# Altium schematic sheet taideng.SchDoc
size A4
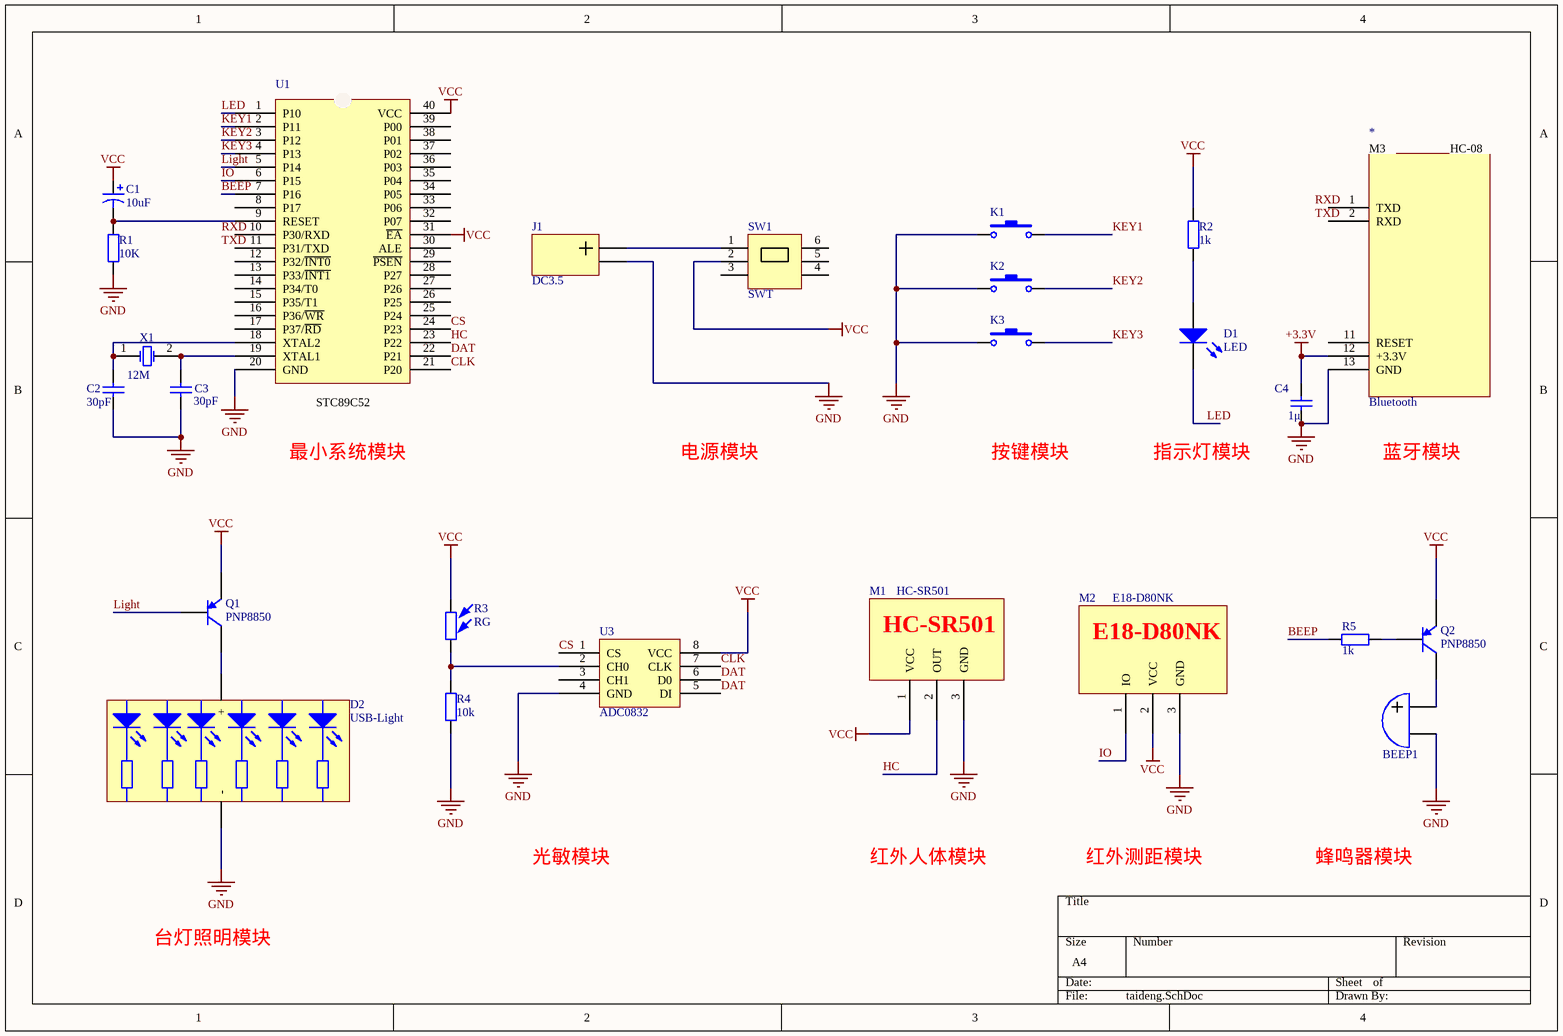
[diagram p0: taideng.SchDoc]

## Parts
*  Bluetooth  [HC-08V20/22/41]
BEEP1  BEEP  [BEEP]  (value not drawn)
C1  10uF  [CAP_2]
C2  30pF  [CAP]
C3  30pF  [CAP]
C4  1μ  [CAP]
D1  LED  [LED]
D2  USB-Light  [USB-A - 2]
J1  DC3.5  [DC3.5]
K1  KEY  [KEY]  (value not drawn)
K2  KEY  [KEY]  (value not drawn)
K3  KEY  [KEY]  (value not drawn)
M1  HC-SR501  [HC-SR501]
M2  E18-D80NK  [SIP3]
Q1  PNP8850  [NPN]
Q2  PNP8850  [NPN]
R1  10K  [RES]
R2  1k  [RES]
R3  RG  [RG]
R4  10k  [RES]
R5  1k  [RES]
SW1  SWT  [SWT]
U1  STC89C52  [DIP40]  (value not drawn)
U3  ADC0832  [DIP8]
X1  12M  [XTAL]

## Nets
+3.3V: *.12(+3.3V) C4.2
GND: *.13(GND) BEEP1.2 C2.1 C3.1 C4.1 D2.2(-) J1.2 K1.1 K2.1 K3.1 M1.3(GND) M2.3(GND) R1.1 R4.1 U1.20(GND) U3.4(GND)
VCC: C1.1 M1.1(VCC) M2.2(VCC) Q1.E Q2.E R2.2 R3.1 SW1.2 U1.31(~{EA}) U1.40(VCC) U3.8(VCC)
BEEP: R5.1 U1.7(P16)
CLK: U1.21(P20) U3.7(CLK)
CS: U1.24(P23) U3.1(CS)
DAT: U1.22(P21) U3.5(DI) U3.6(D0)
HC: M1.2(OUT) U1.23(P22)
IO: M2.1(IO) U1.6(P15)
KEY1: K1.2 U1.2(P11)
KEY2: K2.2 U1.3(P12)
KEY3: K3.2 U1.4(P13)
LED: D1.2 U1.1(P10)
Light: Q1.B U1.5(P14)
NetBEEP1_1: BEEP1.1 Q2.C
NetC1_2: C1.2 R1.2 U1.9(RESET)
NetC2_2: C2.2 U1.18(XTAL2) X1.1(OSC1)
NetC3_2: C3.2 U1.19(XTAL1) X1.2(OSC2)
NetD1_1: D1.1 R2.1
NetD2_1: D2.1(+) Q1.C
NetJ1_1: J1.1 SW1.1
NetQ2_B: Q2.B R5.2
NetR3_2: R3.2 R4.2 U3.2(CH0)

Not connected (* = marked no-connect by the designer): * 1(TXD) 2(RXD) 11(RESET); SW1 3(2) 4(3) 5(4) 6(5); U1 8(P17) 10(P30/RXD) 11(P31/TXD) 12(P32/~{INT0}) 13(P33/~{INT1}) 14(P34/T0) 15(P35/T1) 16(P36/~{WR}) 17(P37/~{RD}) 25(P24) 26(P25) 27(P26) 28(P27) 29(~{PSEN}) 30(ALE) 32(P07) 33(P06) 34(P05) 35(P04) 36(P03) 37(P02) 38(P01) 39(P00); U3 3(CH1)

## Notes on the sheet
- (near U1) STC89C52
- 最小系统模块
- 电源模块
- 按键模块
- 指示灯模块
- 蓝牙模块
- 光敏模块
- 红外人体模块
- 红外测距模块
- 蜂鸣器模块
- 台灯照明模块
- Labels drawn without touching a wire or pin: RXD, TXD
- (in symbol Bluetooth) M3; HC-08

## Library data of the parts
C1 = CAP_2
C2-C4 = CAP
Q1 Q2 = PNP
R1 R2 R4 R5 = Res
X1 = XTAL